# EasyEDA schematic schematic.json
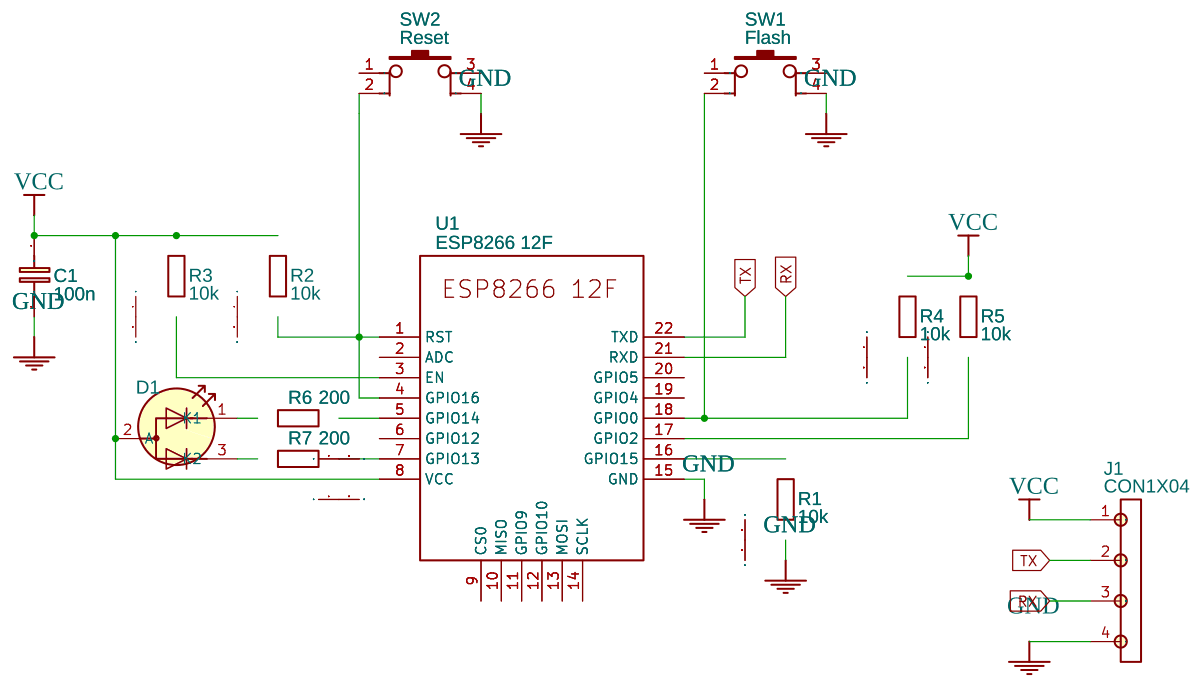
[diagram p0: schematic sheet]

## Parts
C1  100n  [C1206]
D1  LED_Dual_CAC  [3PIN]
J1  CON1X04  [4PIN_HEADER]
R1  10k  [R0805]
R2  10k  [R0805]
R3  10k  [R0805]
R4  10k  [R0805]
R5  10k  [R0805]
R6  200  [R0805]
R7  200  [R0805]
SW1  Flash  [SW-TH_4PIN-L6.00-W6.00]
SW2  Reset  [SW-TH_4PIN-L6.00-W6.00]
U1  ESP8266 12F  [ESP8266 12F MODULE]

## Library data of the parts
C1 = Capacitor: Manufacturer Part: ?
D1 = -: Contributor: KiCAD; license: https://www.gnu.org/licenses/lgpl-2.1.html
J1 = -: Contributor: KiCad
R1-R7 = Resistor: Manufacturer Part: ?
SW1 SW2 = 6*6*13: Supplier Part: C69940; Supplier: LCSC; Manufacturer: ReliaPro
U1 = -: Contributor: gerdmuller.de; sourceId: wXx7531YW; Manufacturer Part: ?

## Nets
GND: C1.2 J1.4 R1.1 SW1.4 SW2.4 U1.15(GND)
VCC: C1.1 D1.2(A) J1.1 R2.2 R3.2 R4.2 R5.2 U1.8(VCC)
RX: J1.3 U1.21(RXD)
TX: J1.2 U1.22(TXD)
Net-(D1-1): D1.1(K1) R6.2
Net-(D1-3): D1.3(K2) R7.2
Net-(R1-2): R1.2 U1.16(GPIO15)
Net-(R2-1): R2.1 SW2.2 U1.1(RST) U1.4(GPIO16)
Net-(R3-1): R3.1 U1.3(EN)
Net-(R4-1): R4.1 SW1.2 U1.18(GPIO0)
Net-(R5-1): R5.1 U1.17(GPIO2)
Net-(R6-1): R6.1 U1.5(GPIO14)
Net-(R7-1): R7.1 U1.7(GPIO13)

Not connected (* = marked no-connect by the designer): SW1 1 3; SW2 1 3; U1 2(ADC) 6(GPIO12) 9(CS0) 10(MISO) 11(GPIO9) 12(GPIO10) 13(MOSI) 14(SCLK) 19(GPIO4) 20(GPIO5)
